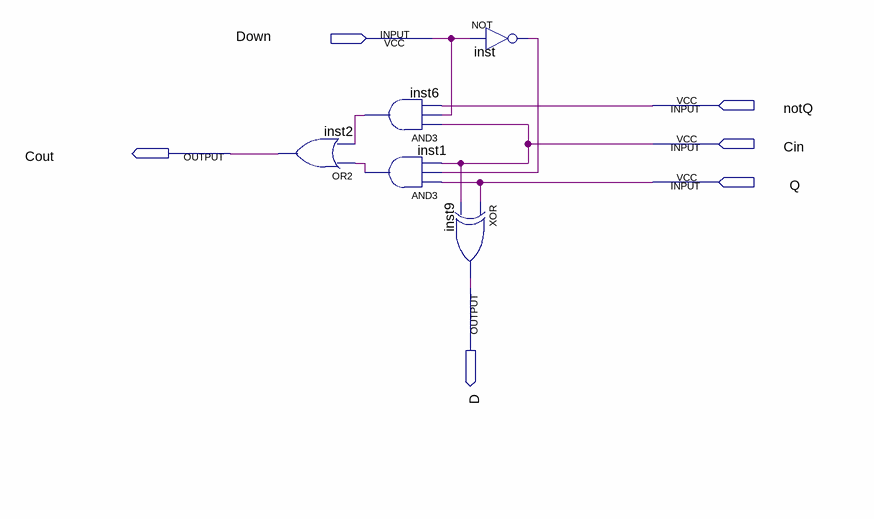
[diagram p0: schematic sheet]
// Quartus schematic HAS.bdf as structural Verilog: 5 symbols, 6 pins
module HAS (
  input  Down,
  input  notQ,
  input  Cin,
  input  Q,
  output Cout,
  output D
);

  wire inst1_out, inst6_out, inst_out;

  or inst2 (Cout, inst1_out, inst6_out);
  and inst6 (inst6_out, Cin, Down, notQ);
  and inst1 (inst1_out, Q, inst_out, Cin);
  xor inst9 (D, Q, Cin);
  not inst (inst_out, Down);
endmodule
